# EAGLE design mainboard (EAGLE 6.5.0)
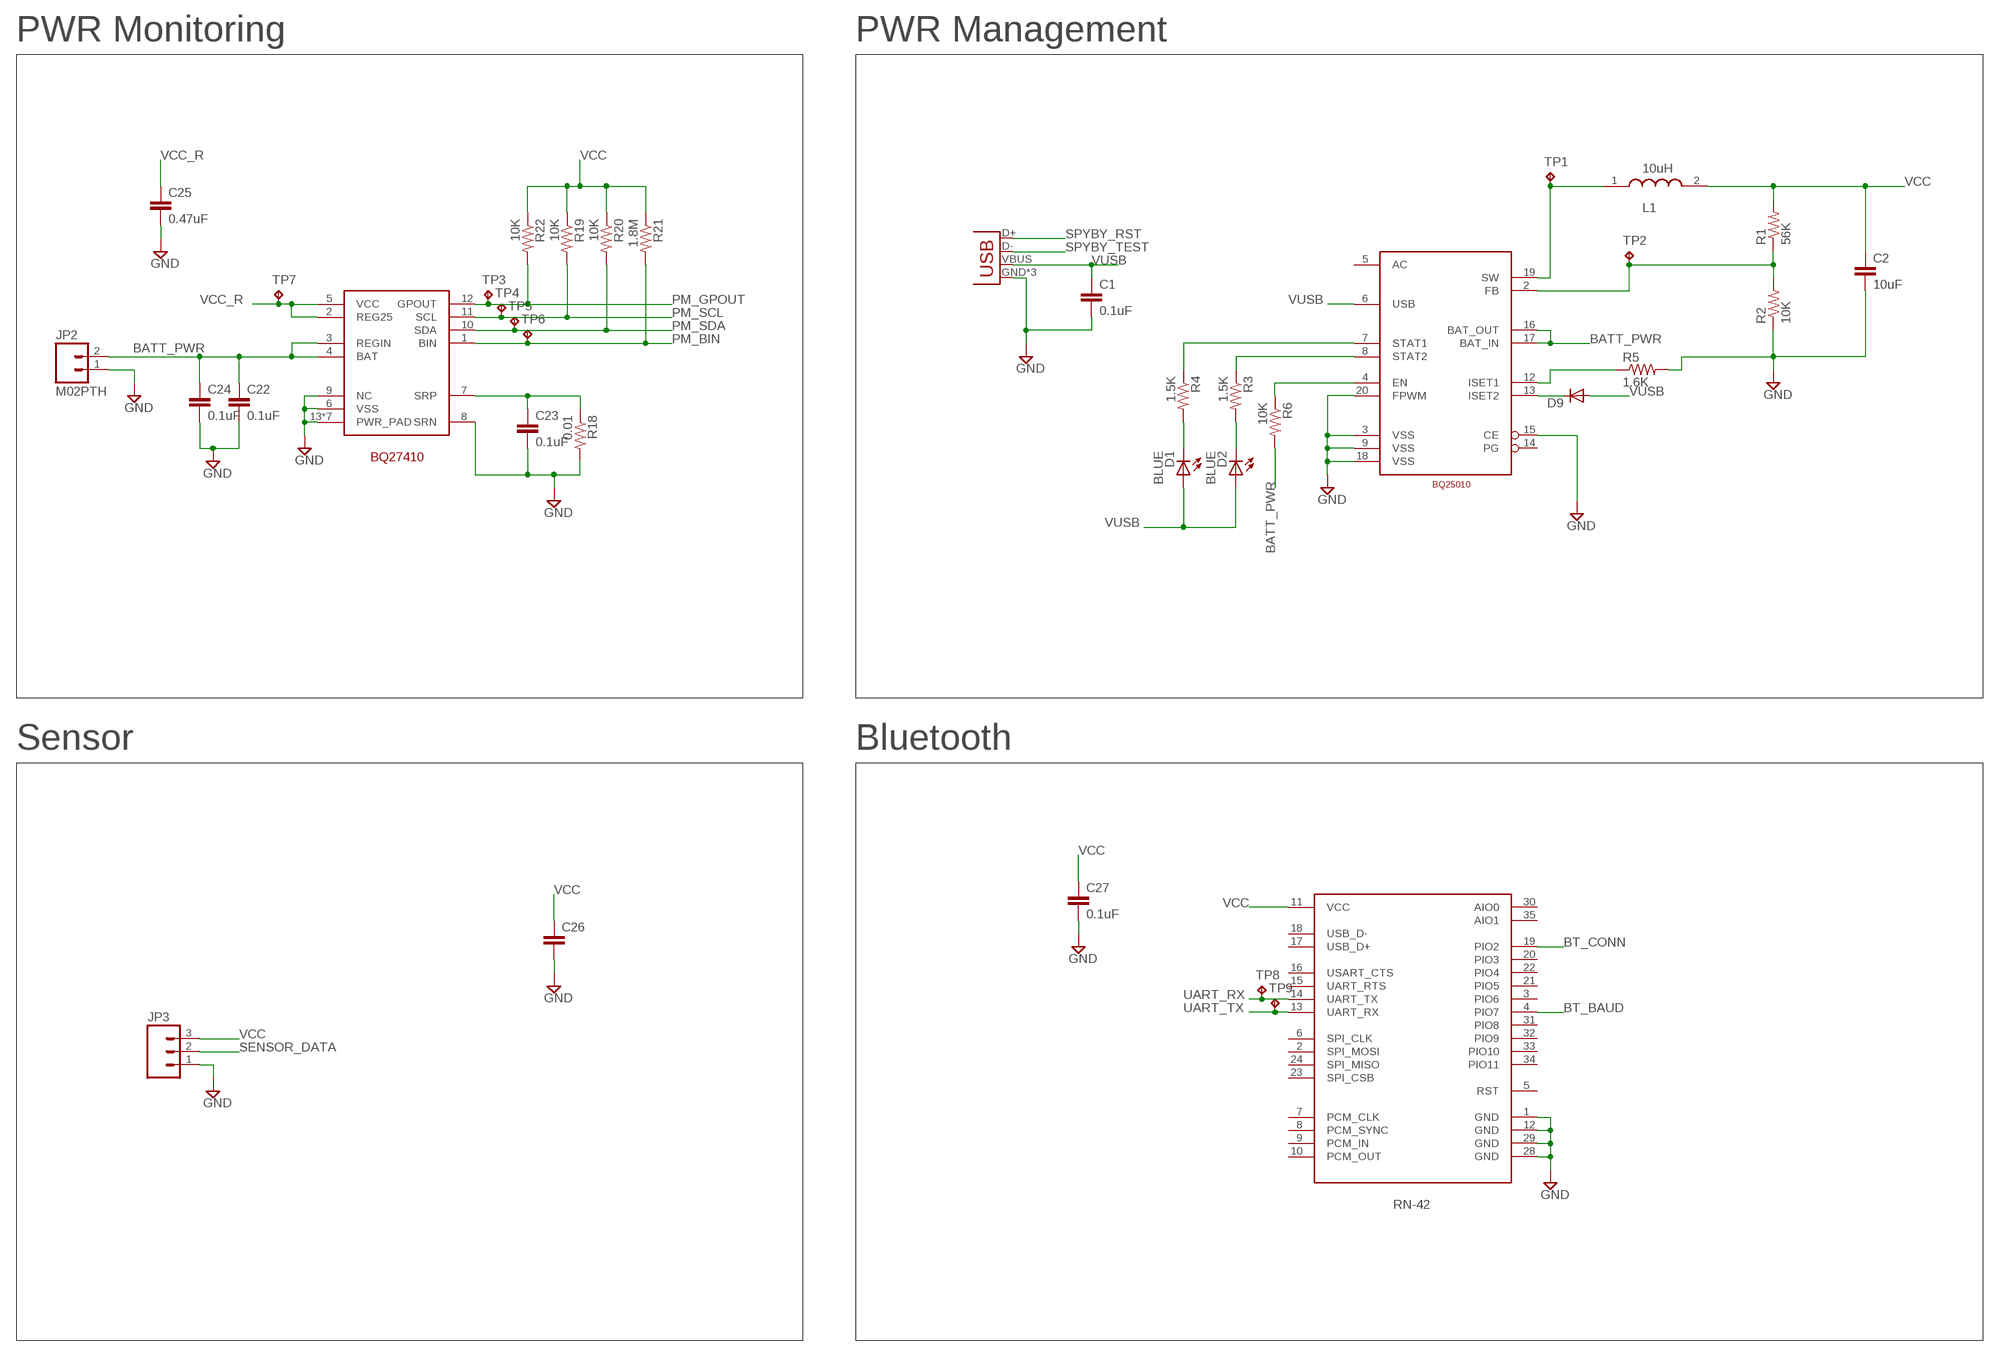
[diagram p0: schematic, sheet 1, part 1 of 2]
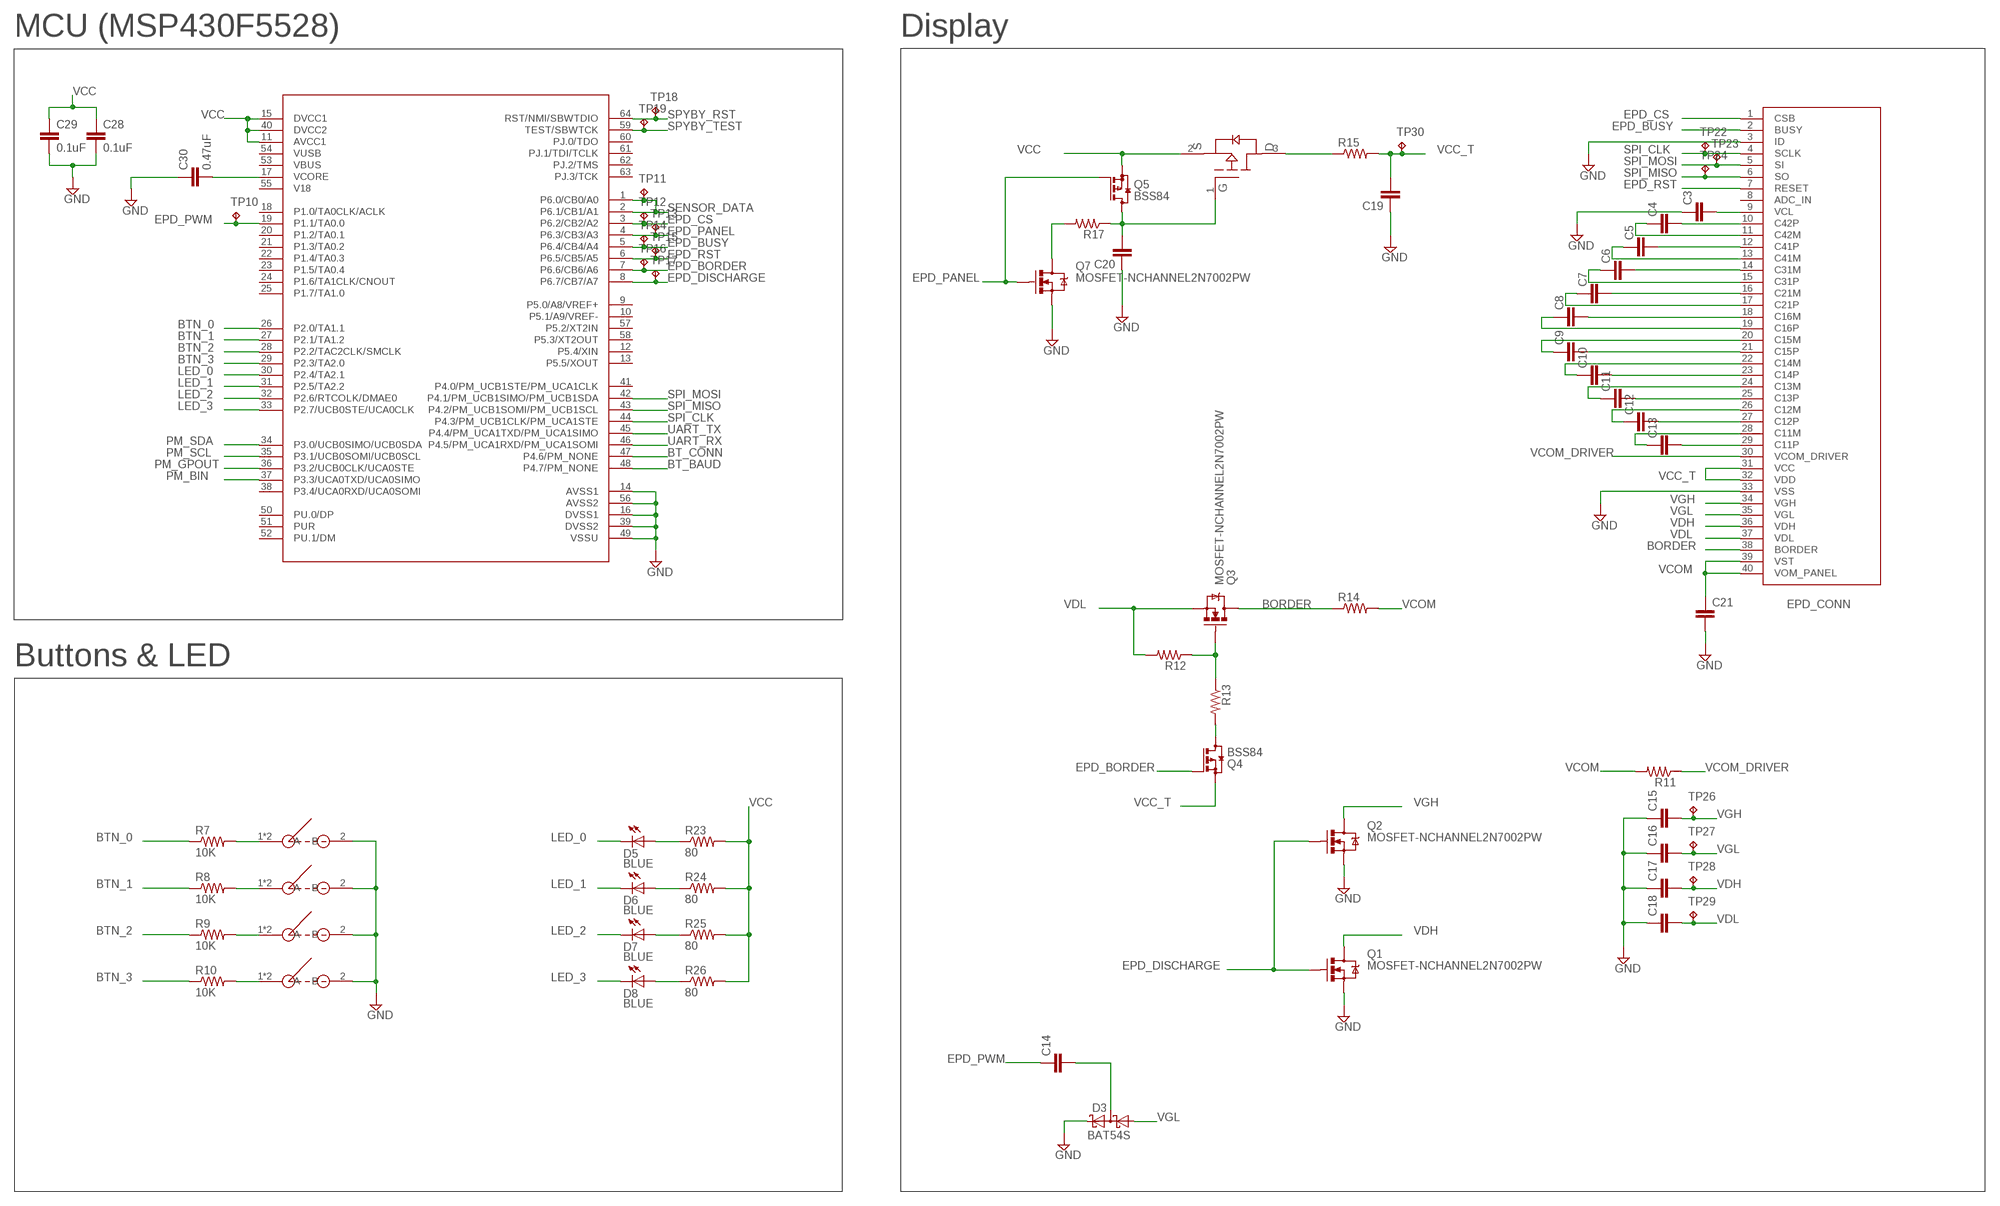
[diagram p1: schematic, sheet 1, part 2 of 2]

## Parts
C1  0.1uF  CAP0402-CAP  [0402-CAP]
C2  10uF  CAP0402-CAP  [0402-CAP]
C3  CAP0402-CAP  [0402-CAP]
C4  CAP0402-CAP  [0402-CAP]
C5  CAP0402-CAP  [0402-CAP]
C6  CAP0402-CAP  [0402-CAP]
C7  CAP0402-CAP  [0402-CAP]
C8  CAP0402-CAP  [0402-CAP]
C9  CAP0402-CAP  [0402-CAP]
C10  CAP0402-CAP  [0402-CAP]
C11  CAP0402-CAP  [0402-CAP]
C12  CAP0402-CAP  [0402-CAP]
C13  CAP0402-CAP  [0402-CAP]
C14  CAP0402-CAP  [0402-CAP]
C15  CAP0402-CAP  [0402-CAP]
C16  CAP0402-CAP  [0402-CAP]
C17  CAP0402-CAP  [0402-CAP]
C18  CAP0402-CAP  [0402-CAP]
C19  CAP0402-CAP  [0402-CAP]
C20  CAP0402-CAP  [0402-CAP]
C21  CAP0402-CAP  [0402-CAP]
C22  0.1uF  CAP0402-CAP  [0402-CAP]
C23  0.1uF  CAP0402-CAP  [0402-CAP]
C24  0.1uF  CAP0402-CAP  [0402-CAP]
C25  0.47uF  CAP0402-CAP  [0402-CAP]
C26  CAP0402-CAP  [0402-CAP]
C27  0.1uF  CAP0402-CAP  [0402-CAP]
C28  0.1uF  CAP0402-CAP  [0402-CAP]
C29  0.1uF  CAP0402-CAP  [0402-CAP]
C30  0.47uF  CAP0402-CAP  [0402-CAP]
D1  BLUE  LED-BLUE0603  [LED-0603]
D2  BLUE  LED-BLUE0603  [LED-0603]
D3  BAT54S  [SOT23]
D5  BLUE  LED-BLUE0603  [LED-0603]
D6  BLUE  LED-BLUE0603  [LED-0603]
D7  BLUE  LED-BLUE0603  [LED-0603]
D8  BLUE  LED-BLUE0603  [LED-0603]
D9  DIODESOD523  [SOD523]
JP1  USB-MICROB  [USB-MICROB]
JP2  M02PTH  [1X02]
JP3  M03PTH  [1X03]
L1  10uH  ASPI-0428S-100M-T  [ASPI_0428S-100M-T]
Q1  MOSFET-NCHANNEL2N7002PW  [SOT323]
Q2  MOSFET-NCHANNEL2N7002PW  [SOT323]
Q3  MOSFET-NCHANNEL2N7002PW  [SOT323]
Q4  BSS84  [SOT23]
Q5  BSS84  [SOT23]
Q7  MOSFET-NCHANNEL2N7002PW  [SOT323]
R1  56K  RESISTOR0402-RES  [0402-RES]
R2  10K  RESISTOR0402-RES  [0402-RES]
R3  1.5K  RESISTOR0402-RES  [0402-RES]
R4  1.5K  RESISTOR0402-RES  [0402-RES]
R5  1.6K  RESISTOR0402-RES  [0402-RES]
R6  10K  RESISTOR0402-RES  [0402-RES]
R7  10K  RESISTOR0402-RES  [0402-RES]
R8  10K  RESISTOR0402-RES  [0402-RES]
R9  10K  RESISTOR0402-RES  [0402-RES]
R10  10K  RESISTOR0402-RES  [0402-RES]
R11  RESISTOR0402-RES  [0402-RES]
R12  RESISTOR0402-RES  [0402-RES]
R13  RESISTOR0402-RES  [0402-RES]
R14  RESISTOR0402-RES  [0402-RES]
R15  RESISTOR0402-RES  [0402-RES]
R17  RESISTOR0402-RES  [0402-RES]
R18  0.01  RESISTOR0402-RES  [0402-RES]
R19  10K  RESISTOR0402-RES  [0402-RES]
R20  10K  RESISTOR0402-RES  [0402-RES]
R21  1.8M  RESISTOR0402-RES  [0402-RES]
R22  10K  RESISTOR0402-RES  [0402-RES]
R23  80  RESISTOR0402-RES  [0402-RES]
R24  80  RESISTOR0402-RES  [0402-RES]
R25  80  RESISTOR0402-RES  [0402-RES]
R26  80  RESISTOR0402-RES  [0402-RES]
TP1  TPB1,27  [B1,27]
TP2  TPB1,27  [B1,27]
TP3  TPB1,27  [B1,27]
TP4  TPB1,27  [B1,27]
TP5  TPB1,27  [B1,27]
TP6  TPB1,27  [B1,27]
TP7  TPB1,27  [B1,27]
TP8  TPB1,27  [B1,27]
TP9  TPB1,27  [B1,27]
TP10  TPB1,27  [B1,27]
TP11  TPB1,27  [B1,27]
TP12  TPB1,27  [B1,27]
TP13  TPB1,27  [B1,27]
TP14  TPB1,27  [B1,27]
TP15  TPB1,27  [B1,27]
TP16  TPB1,27  [B1,27]
TP17  TPB1,27  [B1,27]
TP18  TPB1,27  [B1,27]
TP19  TPB1,27  [B1,27]
TP22  TPB1,27  [B1,27]
TP23  TPB1,27  [B1,27]
TP24  TPB1,27  [B1,27]
TP26  TPB1,27  [B1,27]
TP27  TPB1,27  [B1,27]
TP28  TPB1,27  [B1,27]
TP29  TPB1,27  [B1,27]
TP30  TPB1,27  [B1,27]
U$1  MSP430F5528  [VQFN_RGC_64PIN]
U$2  RN-42  [RN-42]
U$3  BQ25010  [VQFN_RHL_20PIN]
U$4  EVP-AEDB2A  [EVP-AEDB2A]
U$5  EVP-AEDB2A  [EVP-AEDB2A]
U$6  EVP-AEDB2A  [EVP-AEDB2A]
U$7  EVP-AEDB2A  [EVP-AEDB2A]
U$8  FH12-40S-0.5SH  [FH12-40S-0.5SH]
U$9  BQ27410  [SON_DRZ_12PIN]
U$10  DMG2305UX  [SOT23]

## Nets
BATT_PWR: C22.1 C24.1 JP2.2 R6.2 U$3.16(BAT_OUT) U$3.17(BAT_IN) U$9.3(REGIN) U$9.4(BAT)
BORDER: Q3.3(D) R14.1 U$8.38(BORDER)
BT_BAUD: U$1.48(P4.7/PM_NONE) U$2.4(PIO7)
BT_CONN: U$1.47(P4.6/PM_NONE) U$2.19(PIO2)
BTN_0: R7.1 U$1.26(P2.0/TA1.1)
BTN_1: R8.1 U$1.27(P2.1/TA1.2)
BTN_2: R9.1 U$1.28(P2.2/TAC2CLK/SMCLK)
BTN_3: R10.1 U$1.29(P2.3/TA2.0)
EPD_BORDER: Q4.1(G) TP16.TP U$1.7(P6.6/CB6/A6)
EPD_BUSY: TP14.TP U$1.5(P6.4/CB4/A4) U$8.2(BUSY)
EPD_CS: TP12.TP U$1.3(P6.2/CB2/A2) U$8.1(CSB)
EPD_DISCHARGE: Q1.1(G) Q2.1(G) TP17.TP U$1.8(P6.7/CB7/A7)
EPD_PANEL: Q5.1(G) Q7.1(G) TP13.TP U$1.4(P6.3/CB3/A3)
EPD_PWM: C14.1 TP10.TP U$1.19(P1.1/TA0.0)
EPD_RST: TP15.TP U$1.6(P6.5/CB5/A5) U$8.7(RESET)
GND [GND]: C1.2 C2.2 C3.1 C15.1 C16.1 C17.1 C18.1 C19.1 C20.1 C21.2 C22.2 C23.2 C24.2 C25.2 C26.2 C27.2 C28.2 C29.2 C30.1 D3.2(C2) JP1.GND JP1.MT1(GND) JP1.MT2(GND) JP2.1 JP3.1 Q1.2(S) Q2.2(S) Q7.2(S) R2.1 R5.2 R18.2 U$1.14(AVSS1) U$1.16(DVSS1) U$1.39(DVSS2) U$1.49(VSSU) U$1.56(AVSS2) U$2.1(GND) U$2.12(GND) U$2.28(GND) U$2.29(GND) U$3.3(VSS) U$3.9(VSS) U$3.15(CE) U$3.18(VSS) U$3.20(FPWM) U$4.2(B) U$5.2(B) U$6.2(B) U$7.2(B) U$8.3(ID) U$8.33(VSS) U$9.6(VSS) U$9.8(SRN) U$9.9(NC) U$9.13(PWR_PAD) U$9.P$15(PWR_PAD) U$9.P$16(PWR_PAD) U$9.P$17(PWR_PAD) U$9.P$18(PWR_PAD) U$9.P$19(PWR_PAD) U$9.P$20(PWR_PAD)
LED_0: D5.C U$1.30(P2.4/TA2.1)
LED_1: D6.C U$1.31(P2.5/TA2.2)
LED_2: D7.C U$1.32(P2.6/RTCOLK/DMAE0)
LED_3: D8.C U$1.33(P2.7/UCB0STE/UCA0CLK)
N$1: R5.1 U$3.12(ISET1)
N$2: D1.C R4.2
N$3: D9.C U$3.13(ISET2)
N$4: D2.C R3.2
N$5: R1.1 R2.2 TP2.TP U$3.2(FB)
N$6: L1.1 TP1.TP U$3.19(SW)
N$7: C30.2 U$1.17(VCORE)
N$8: Q4.3(D) R13.2
N$9: C14.2 D3.3(C1A2)
N$10: R4.1 U$3.7(STAT1)
N$11: R3.1 U$3.8(STAT2)
N$12: R6.1 U$3.4(EN)
N$13: R7.2 U$4.1'(A) U$4.1(A)
N$14: R8.2 U$5.1'(A) U$5.1(A)
N$15: R9.2 U$6.1'(A) U$6.1(A)
N$16: R10.2 U$7.1'(A) U$7.1(A)
N$26: C4.2 U$8.10(C42P)
N$27: C4.1 U$8.11(C42M)
N$28: C5.2 U$8.12(C41P)
N$29: C5.1 U$8.13(C41M)
N$30: C6.2 U$8.14(C31M)
N$31: C6.1 U$8.15(C31P)
N$32: C7.2 U$8.16(C21M)
N$33: C7.1 U$8.17(C21P)
N$34: C8.2 U$8.18(C16M)
N$35: C8.1 U$8.19(C16P)
N$36: C9.1 U$8.20(C15M)
N$37: C9.2 U$8.21(C15P)
N$38: C10.1 U$8.22(C14M)
N$39: C10.2 U$8.23(C14P)
N$40: C11.1 U$8.24(C13M)
N$41: C11.2 U$8.25(C13P)
N$42: C12.1 U$8.26(C12M)
N$43: C12.2 U$8.27(C12P)
N$44: C13.1 U$8.28(C11M)
N$45: C13.2 U$8.29(C11P)
N$46: C3.2 U$8.9(VCL)
N$47: R15.1 U$10.3(DRAIN)
N$48: D5.A R23.1
N$49: Q3.1(G) R12.1 R13.1
N$50: C20.2 Q5.3(D) R17.1 U$10.1(GATE)
N$51: D6.A R24.1
N$52: Q7.3(D) R17.2
N$54: C23.1 R18.1 U$9.7(SRP)
N$55: D7.A R25.1
N$56: D8.A R26.1
PM_BIN: R21.2 TP6.TP U$1.37(P3.3/UCA0TXD/UCA0SIMO) U$9.1(BIN)
PM_GPOUT: R22.2 TP3.TP U$1.36(P3.2/UCB0CLK/UCA0STE) U$9.12(GPOUT)
PM_SCL: R19.2 TP4.TP U$1.35(P3.1/UCB0SOMI/UCB0SCL) U$9.11(SCL)
PM_SDA: R20.2 TP5.TP U$1.34(P3.0/UCB0SIMO/UCB0SDA) U$9.10(SDA)
SENSOR_DATA: JP3.2 TP11.TP U$1.1(P6.0/CB0/A0) U$1.2(P6.1/CB1/A1)
SPI_CLK: TP22.TP U$1.44(P4.3/PM_UCB1CLK/PM_UCA1STE) U$8.4(SCLK)
SPI_MISO: TP24.TP U$1.43(P4.2/PM_UCB1SOMI/PM_UCB1SCL) U$8.6(SO)
SPI_MOSI: TP23.TP U$1.42(P4.1/PM_UCB1SIMO/PM_UCB1SDA) U$8.5(SI)
SPYBY_RST: JP1.D+ TP18.TP U$1.64(RST/NMI/SBWTDIO)
SPYBY_TEST: JP1.D- TP19.TP U$1.59(TEST/SBWTCK)
UART_RX: TP8.TP U$1.46(P4.5/PM_UCA1RXD/PM_UCA1SOMI) U$2.14(UART_TX)
UART_TX: TP9.TP U$1.45(P4.4/PM_UCA1TXD/PM_UCA1SIMO) U$2.13(UART_RX)
VCC [VCC]: C2.1 C26.1 C27.1 C28.1 C29.1 JP3.3 L1.2 Q5.2(S) R1.2 R19.1 R20.1 R21.1 R22.1 R23.2 R24.2 R25.2 R26.2 U$1.11(AVCC1) U$1.15(DVCC1) U$1.40(DVCC2) U$2.11(VCC) U$10.2(SOURCE)
VCC_R: C25.1 TP7.TP U$9.2(REG25) U$9.5(VCC)
VCC_T: C19.2 Q4.2(S) R15.2 TP30.TP U$8.31(VCC) U$8.32(VDD)
VCOM: C21.1 R11.2 R14.2 U$8.39(VST) U$8.40(VOM_PANEL)
VCOM_DRIVER: R11.1 U$8.30(VCOM_DRIVER)
VDH: C17.2 Q1.3(D) TP28.TP U$8.36(VDH)
VDL: C18.2 Q3.2(S) R12.2 TP29.TP U$8.37(VDL)
VGH: C15.2 Q2.3(D) TP26.TP U$8.34(VGH)
VGL: C16.2 D3.1(A1) TP27.TP U$8.35(VGL)
VUSB: C1.1 D1.A D2.A D9.A JP1.VBUS U$3.6(USB)
Unconnected: U$1.9(P5.0/A8/VREF+) U$1.10(P5.1/A9/VREF-) U$1.12(P5.4/XIN) U$1.13(P5.5/XOUT) U$1.18(P1.0/TA0CLK/ACLK) U$1.20(P1.2/TA0.1) U$1.21(P1.3/TA0.2) U$1.22(P1.4/TA0.3) U$1.23(P1.5/TA0.4) U$1.24(P1.6/TA1CLK/CNOUT) U$1.25(P1.7/TA1.0) U$1.38(P3.4/UCA0RXD/UCA0SOMI) U$1.41(P4.0/PM_UCB1STE/PM_UCA1CLK) U$1.50(PU.0/DP) U$1.51(PUR) U$1.52(PU.1/DM) U$1.53(VBUS) U$1.54(VUSB) U$1.55(V18) U$1.57(P5.2/XT2IN) U$1.58(P5.3/XT2OUT) U$1.60(PJ.0/TDO) U$1.61(PJ.1/TDI/TCLK) U$1.62(PJ.2/TMS) U$1.63(PJ.3/TCK) U$2.2(SPI_MOSI) U$2.3(PIO6) U$2.5(RST) U$2.6(SPI_CLK) U$2.7(PCM_CLK) U$2.8(PCM_SYNC) U$2.9(PCM_IN) U$2.10(PCM_OUT) U$2.15(UART_RTS) U$2.16(USART_CTS) U$2.17(USB_D+) U$2.18(USB_D-) U$2.20(PIO3) U$2.21(PIO5) U$2.22(PIO4) U$2.23(SPI_CSB) U$2.24(SPI_MISO) U$2.30(AIO0) U$2.31(PIO8) U$2.32(PIO9) U$2.33(PIO10) U$2.34(PIO11) U$2.35(AIO1) U$3.5(AC) U$3.14(PG) U$8.8(ADC_IN)

## Notes on the sheet
- PWR Monitoring | PWR Management | MCU (MSP430F5528) | Display
- 10uH
- L1
- Sensor | Bluetooth | Buttons & LED

## Library data of the parts
C1-C30 = SparkFun-Capacitors:CAP: Capacitor Standard 0603 ceramic capacitor, and 0.1" leaded capacitor.
D1 D2 D5-D8 = SparkFun-LED:LED-BLUE: Blue LEDs for production use Various blue LEDs stocked by SparkFun production 0603 - DIO-08575 Rebel - DIO-09553 1206 - DIO-09911; PROD_ID: DIO-08575
D3 = diode:BAT54S: Schottky Diodes Pin connection corrected 2011-05-04 Source: Fairchild .. BAT54.pdf
D9 = SparkFun-DiscreteSemi:DIODE: Diode These are standard reverse protection diodes and small signal diodes. SMA package can handle up to about 1A. SOD-323 can handle about 200mA. What the SOD-323 package when ordering, there are some mfgs out there that are 5-pin packages.
JP1 = SparkFun-Connectors:USB: USB Connectors USB-B-PTH is fully proven SKU : PRT-00139/CONN-08278 USB-miniB is fully proven SKU : PRT-00587 USB-A-PCB is untested. USB-A-H is throughly reviewed, but untested. Spark Fun Electronics SKU : PRT-00437 USB-B-SMT is throughly reviewed, but untested. Needs silkscreen touching up. USB-A-S has not been used/tested USB-MB-H has not been used/tested USB-MICROB has been used. CONN-09505; PROD_ID: CONN-09505
JP2 = SparkFun-Connectors:M02: Standard 2-pin 0.1" header. Use with - straight break away headers ( PRT-00116) - right angle break away headers (PRT-00553) - swiss pins (PRT-00743) - machine pins (PRT-00117) - female headers (PRT-00115) Molex polarized connector foot print use with: PRT-08233 with associated crimp pins and housings. 2.54_SCREWTERM for use with PRT-10571. 3.5mm Screw Terminal footprints for PRT-08084 5mm Screw Terminal footprints for use with PRT-08433
JP3 = SparkFun-Connectors:M03: Header 3 Standard 3-pin 0.1" header. Use with straight break away headers (SKU : PRT-00116), right angle break away headers (PRT-00553), swiss pins (PRT-00743), machine pins (PRT-00117), and female headers (PRT-00115). Molex polarized connector foot print use with SKU : PRT-08232 with associated crimp pins and housings.
L1 = TuansLib:ASPI-0428S-100M-T
Q1-Q3 Q7 = SparkFun-DiscreteSemi:MOSFET-NCHANNEL: Common NMOSFET Parts MFG P/N Store ID Prod ID FDD8780 TRANS-09984 SI7820DN TRANS-11055 FDS6630A IC-08089 2N7002PW TRANS-11151 FQP30N06L COM-10213 TRANS-10060 BSS123LT1G TRANS-08345 BSS138 TRANS-00830 BS170 2N7000; PROD_ID: TRANS-11151
Q4 Q5 = transistor-small-signal:BSS84: P-CHANNEL MOS FET
R1-R15 R17-R26 = SparkFun-Passives:RESISTOR: Resistor Basic schematic elements and footprints for 0603, 1206, and PTH resistors.
TP1-TP19 TP22-TP24 TP26-TP30 = testpad:TP: Test pad
U$1 = TuansLib:MSP430F5528
U$2 = TuansLib:RN-42
U$3 = TuansLib:BQ25010
U$4-U$7 = TuansLib:EVP-AEDB2A
U$8 = TuansLib:FH12-40S-0.5SH
U$9 = TuansLib:BQ27410
U$10 = TuansLib:DMG2305UX

## Net classes
1 VCC: width 0.254 mm
2 GND: width 0.254 mm

## Board
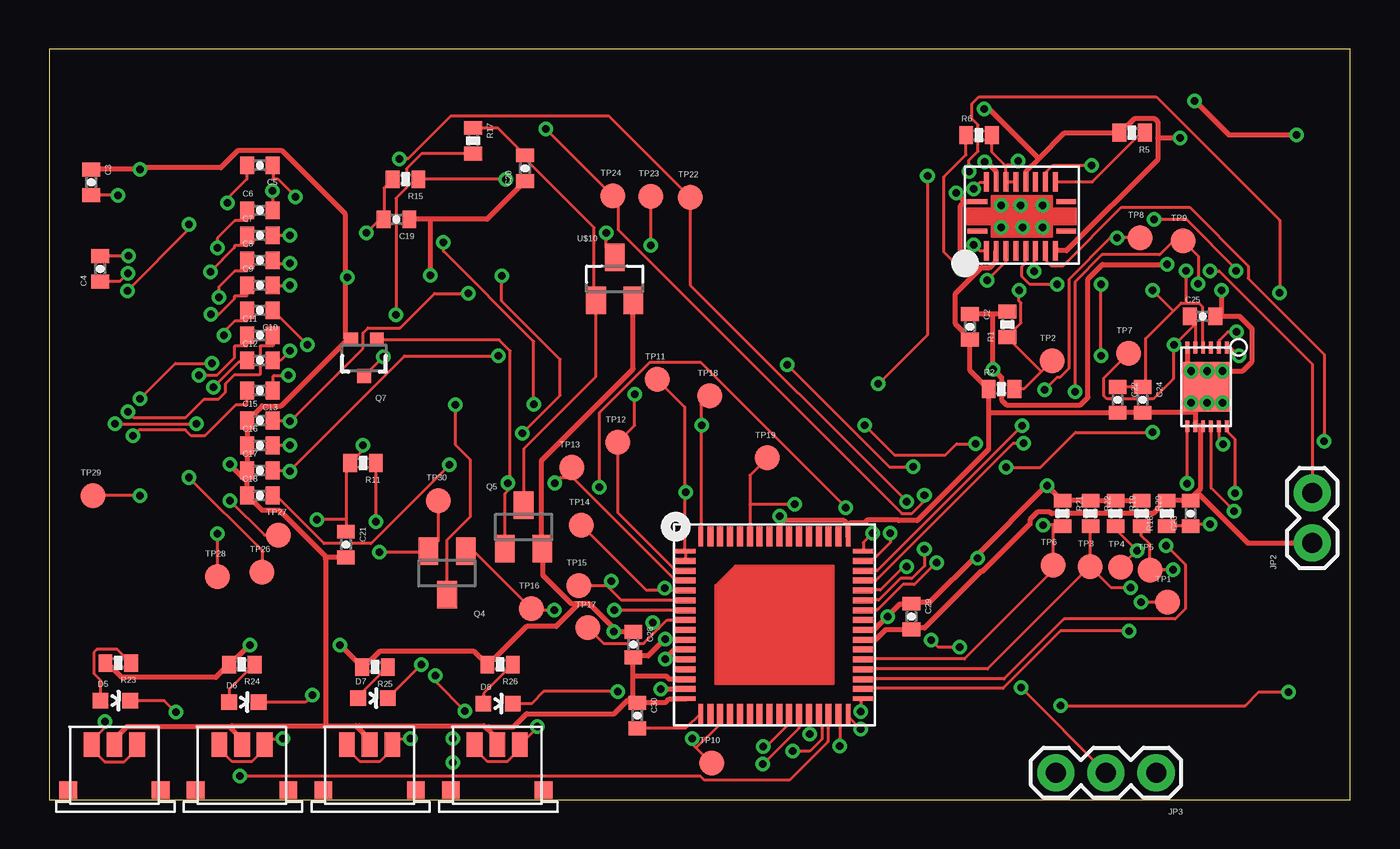
[diagram p2: board, top side]
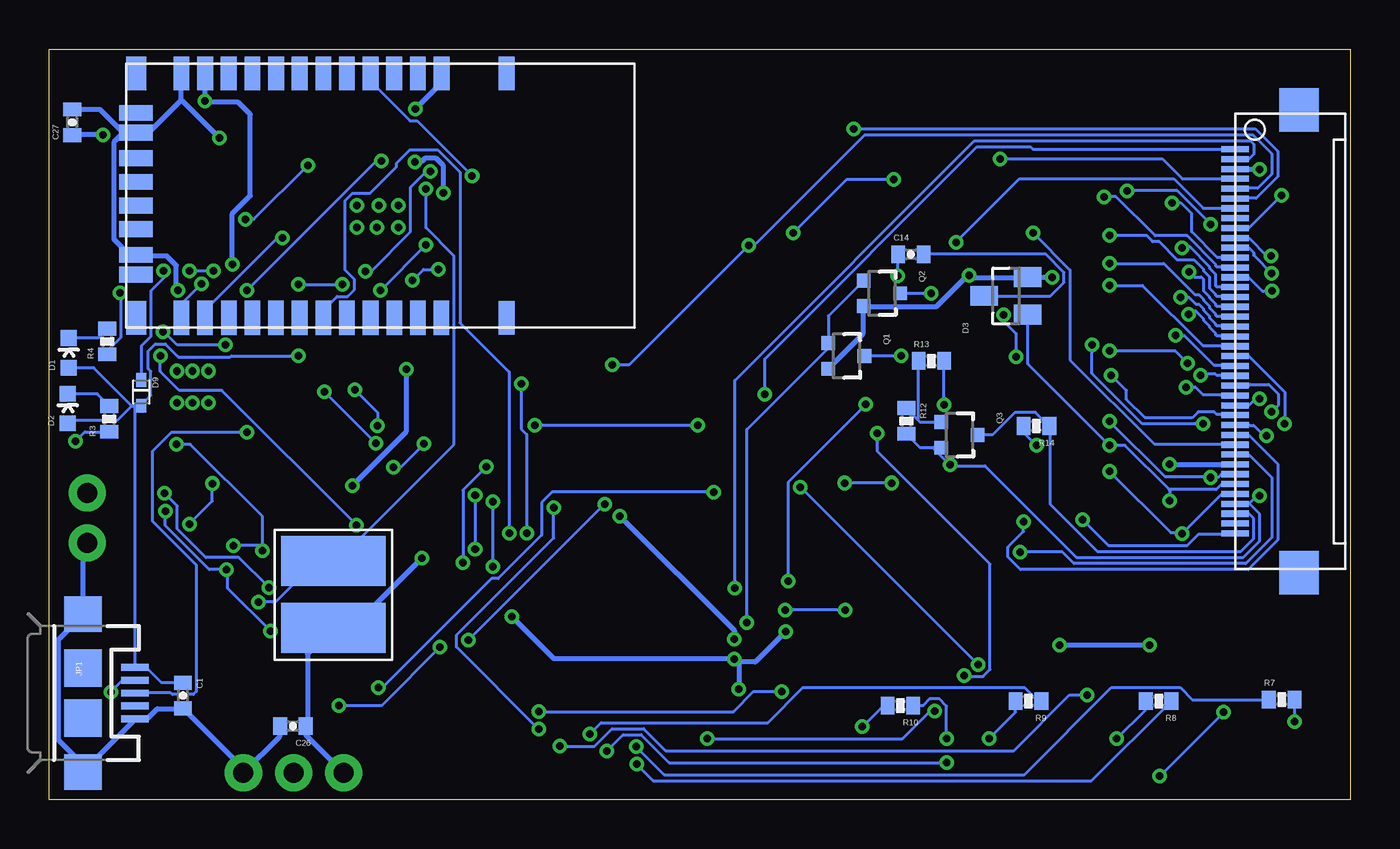
[diagram p3: board, bottom side, seen from below]

Size 66.04 x 38.1 mm. Coordinates in mm from the lower left corner, seen from the top.
Outline: 0,0 66.04,0 66.04,38.1 0,38.1 0,0
Copper layers (1*16): Top 0.035mm / dielectric 1.5mm / Bottom 0.035mm
Design rules "default *": minimum track width 6mil, minimum drill 15mil, track to track 6mil, track to pad 6mil, pad to pad 6mil, via to via 6mil, smd to smd 6mil, copper to edge 10mil, drill to drill 8mil, minimum pad ring 7mil, minimum via ring 7mil, stop-mask expansion 3mil, vias tented up to drill 0mil, thermal gap 10mil

### Footprints (pad centres in the part's own frame; a part is rotated, then mirrored left to right if it is on the bottom)
0402-CAP = smd 0.7 x 0.9: 1 -0.65,0; 2 0.65,0
LED-0603 = smd 0.8 x 0.8: A 0,-0.75; C 0,0.75
SOT23 = smd 1 x 1.4: 1 -0.95,-1.1; 2 0.95,-1.1; 3 0,1.1
SOD523 = smd 0.7 x 0.5: A 0.7,0; C -0.6,0
USB-MICROB = smd 0.35 x 1.4: D+ 0,2.65; D- -0.65,2.65; GND 1.3,2.65; ID 0.65,2.65; VBUS -1.3,2.65 | smd 1.8 x 1.9: MT1 -4,0; MT2 4,0 | smd 1.9 x 1.9: P$1 -1.27,0; P$2 1.27,0
1X02 = drill 1.016 pad 1.88: 1 0,0; 2 2.54,0
1X03 = drill 1.016 pad 1.88: 1 0,0; 2 2.54,0; 3 5.08,0
ASPI_0428S-100M-T = smd 5.309 x 2.54: 1 0,0; 2 0,3.404
SOT323 = smd 0.7 x 0.7: 1 -0.65,-0.925; 2 0.65,-0.925; 3 0,0.925
0402-RES = smd 0.7 x 0.9: 1 -0.65,0; 2 0.65,0
B1,27 = smd 1.27 x 1.27: TP 0,0
VQFN_RGC_64PIN = smd 1.016 x 0.229: 1 0,8.25; 16 0,0.75; 33 9,0.75; 48 9,8.25 | smd 1.016 x 0.305: 2 0,7.75; 3 0,7.25; 4 0,6.75; 5 0,6.25; 6 0,5.75; 7 0,5.25; 8 0,4.75; 9 0,4.25; 10 0,3.75; 11 0,3.25; 12 0,2.75; 13 0,2.25; 14 0,1.75; 15 0,1.25; 34 9,1.25; 35 9,1.75; 36 9,2.25; 37 9,2.75; 38 9,3.25; 39 9,3.75; 40 9,4.25; 41 9,4.75; 42 9,5.25; 43 9,5.75; 44 9,6.25; 45 9,6.75; 46 9,7.25; 47 9,7.75 | smd 0.229 x 1.016: 17 0.75,0; 32 8.25,0; 49 8.25,9; 64 0.75,9 | smd 0.305 x 1.016: 18 1.25,0; 19 1.75,0; 20 2.25,0; 21 2.75,0; 22 3.25,0; 23 3.75,0; 24 4.25,0; 25 4.75,0; 26 5.25,0; 27 5.75,0; 28 6.25,0; 29 6.75,0; 30 7.25,0; 31 7.75,0; 50 7.75,9; 51 7.25,9; 52 6.75,9; 53 6.25,9; 54 5.75,9; 55 5.25,9; 56 4.75,9; 57 4.25,9; 58 3.75,9; 59 3.25,9; 60 2.75,9; 61 2.25,9; 62 1.75,9; 63 1.25,9
RN-42 = smd 1.7 x 0.8: 1 0.5,16; 2 0.5,14.8; 3 0.5,13.6; 4 0.5,12.4; 5 0.5,11.2; 6 0.5,10; 7 0.5,8.8; 8 0.5,7.6; 9 0.5,6.4; 10 0.5,5.2; 11 0.5,4; 12 0.5,2.8; 13 12.9,2.8; 14 12.9,4; 15 12.9,5.2; 16 12.9,6.4; 17 12.9,7.6; 18 12.9,8.8; 19 12.9,10; 20 12.9,11.2; 21 12.9,12.4; 22 12.9,13.6; 23 12.9,14.8; 24 12.9,16; P$35 0.5,19.3; P$36 12.9,19.3 | smd 0.8 x 1.7: 28 9.7,0.5; 29 3.5,0.5; 30 10.7,0.5; 31 8.4,0.5; 32 7.2,0.5; 33 6,0.5; 34 4.8,0.5; 35 2.5,0.5 | smd 1.7 x 1: P$33 0.5,0.5; P$34 12.9,0.5
VQFN_RHL_20PIN = smd 1 x 0.25: 1 0,1; 10 4.5,1; 11 4.5,2.5; 20 0,2.5 | smd 0.25 x 1: 2 0.45,0; 3 0.95,0; 4 1.45,0; 5 1.95,0; 6 2.45,0; 7 2.95,0; 8 3.45,0; 9 3.95,0; 12 3.95,3.5; 13 3.45,3.5; 14 2.95,3.5; 15 2.45,3.5; 16 1.95,3.5; 17 1.45,3.5; 18 0.95,3.5; 19 0.45,3.5 | drill 0.381: P$21 1.2,2.3; P$22 1.2,1.2; P$23 2.3,1.2; P$24 2.2,2.3; P$25 3.3,2.3; P$26 3.3,1.2
EVP-AEDB2A = smd 0.8 x 1.25: 1 0,0; 1' 2.3,0; 2 1.15,0 | smd 0.9 x 0.9: P$4 -1.2,-2.3; P$5 3.5,-2.3
FH12-40S-0.5SH = smd 0.31 x 1.4: 1 0,0; 2 0.5,0; 3 1,0; 4 1.5,0; 5 2,0; 6 2.5,0; 7 3,0; 8 3.5,0; 9 4,0; 10 4.5,0; 11 5,0; 12 5.5,0; 13 6,0; 14 6.5,0; 15 7,0; 16 7.5,0; 17 8,0; 18 8.5,0; 19 9,0; 20 9.5,0; 21 10,0; 22 10.5,0; 23 11,0; 24 11.5,0; 25 12,0; 26 12.5,0; 27 13,0; 28 13.5,0; 29 14,0; 30 14.5,0; 31 15,0; 32 15.5,0; 33 16,0; 34 16.5,0; 35 17,0; 36 17.5,0; 37 18,0; 38 18.5,0; 39 19,0; 40 19.5,0 | smd 2.2 x 2: G@0 -2,3.25; G@1 21.5,3.25
SON_DRZ_12PIN = smd 0.2 x 0.6: 1 0.2,0; 2 0.6,0; 3 1,0; 4 1.4,0; 5 1.8,0; 6 2.2,0; 7 2.2,4; 8 1.8,4; 9 1.4,4; 10 1,4; 11 0.6,4; 12 0.2,4 | smd 2.5 x 2.5: 13 1.25,2 | drill 0.381: P$15 0.4,2.8; P$16 1.2,2.8; P$17 2,2.8; P$18 2,1.2; P$19 1.2,1.2; P$20 0.4,1.2

### Placement (x,y rotation side)
C1  59.26,5.28 270 bottom
C2  46.74,24 270 top
C3  2.13,31.34 270 top
C4  2.59,26.95 90 top
C5  10.69,32.21 180 top
C6  10.69,29.92 0 top
C7  10.69,28.65 0 top
C8  10.69,27.38 0 top
C9  10.69,26.11 0 top
C10  10.69,24.84 180 top
C11  10.69,23.57 0 top
C12  10.69,22.3 0 top
C13  10.69,20.78 180 top
C14  22.3,27.69 0 bottom
C15  10.69,19.25 0 top
C16  10.69,17.98 0 top
C17  10.69,16.71 0 top
C18  10.69,15.44 0 top
C19  17.63,29.46 180 top
C20  24.16,32.05 90 top
C21  15.06,12.95 270 top
C22  54.23,20.29 270 top
C23  57.94,14.53 90 top
C24  55.5,20.29 270 top
C25  58.55,24.54 0 top
C26  53.67,3.73 180 bottom
C27  64.87,34.39 90 bottom
C28  29.64,7.87 270 top
C29  43.76,9.3 270 top
C30  29.84,4.27 270 top
D1  65.05,22.68 0 bottom
D2  65.1,19.86 0 bottom
D3  17.48,25.58 90 bottom
D5  3.35,5.03 270 top
D6  9.88,4.95 270 top
D7  16.43,5.16 270 top
D8  22.78,4.88 270 top
D9  61.37,20.7 270 bottom
JP1  64.34,5.41 270 bottom
JP2  64.11,13.03 90 top
JP3  56.18,1.37 180 top
L1  51.61,12.12 180 bottom
Q1  25.58,22.53 270 bottom
Q2  23.77,25.7 270 bottom
Q3  19.84,18.52 270 bottom
Q4  20.19,11.51 180 top
Q5  24.08,13.84 0 top
Q7  15.98,22.43 180 top
R1  48.64,24.13 90 top
R2  48.34,20.85 0 top
R3  62.99,19.33 90 bottom
R4  63.09,23.27 90 bottom
R5  54.97,33.86 180 top
R6  47.19,33.73 0 top
R7  3.48,5.08 0 bottom
R8  9.73,5 180 bottom
R9  16.33,5 180 bottom
R10  22.83,4.78 180 bottom
R11  15.93,17.09 180 top
R12  22.53,19.23 270 bottom
R13  21.26,22.28 0 bottom
R14  15.93,18.97 180 bottom
R15  18.08,31.5 180 top
R17  21.51,33.45 270 top
R18  56.72,14.53 90 top
R19  54.13,14.53 270 top
R20  55.45,14.53 270 top
R21  51.44,14.53 270 top
R22  52.86,14.53 270 top
R23  3.51,6.93 180 top
R24  9.78,6.86 180 top
R25  16.54,6.73 180 top
R26  22.89,6.86 180 top
TP1  56.77,10.03 0 top
TP2  50.9,22.28 0 top
TP3  52.83,11.84 0 top
TP4  54.38,11.81 0 top
TP5  55.88,11.66 0 top
TP6  50.95,11.91 0 top
TP7  54.79,22.66 0 top
TP8  55.37,28.52 0 top
TP9  57.56,28.37 0 top
TP10  33.63,1.85 0 top
TP11  30.86,21.34 0 top
TP12  28.85,18.14 0 top
TP13  26.52,16.87 0 top
TP14  27,13.94 0 top
TP15  26.87,10.87 0 top
TP16  24.46,9.7 0 top
TP17  27.33,8.74 0 top
TP18  33.53,20.5 0 top
TP19  36.45,17.35 0 top
TP22  32.54,30.58 0 top
TP23  30.53,30.63 0 top
TP24  28.6,30.66 0 top
TP26  10.79,11.56 0 top
TP27  11.63,13.44 0 top
TP28  8.53,11.33 0 top
TP29  2.21,15.44 0 top
TP30  19.76,15.19 0 top
U$1  32.31,4.37 0 top
U$2  62.13,37.36 270 bottom
U$3  47.12,27.86 0 top
U$4  2.16,2.79 0 top
U$5  8.64,2.79 0 top
U$6  15.11,2.79 0 top
U$7  21.59,2.79 0 top
U$8  5.84,33.02 270 bottom
U$9  59.97,22.96 180 top
U$10  28.7,26.44 0 top

### Tracks (layer width: path | path; a pad name or v marks a point on that pad's centre or on a via)
BATT_PWR  (via drill 0.38)
  Top 0.152: 48.56,32.16 47.85,32.87 47.85,33.73 R6.2 | 48.56,32.16 U$3.17 48.64,31.37 49.05,31.37 U$3.16 | U$9.3 U$9.4 58.52,23.01 58.52,25.04 58.34,25.22 57.71,25.22 | 57.71,25.22 57.45,25.22 57.05,24.82 | 57.05,24.82 55.65,23.42 55.65,21.11 55.5,20.95 C24.1 55.45,20.95 54.23,20.95 C22.1 | v49.17,32.44 48.95,32.21 48.62,32.21 48.56,32.16 | 57.05,24.82 v56.01,25.86 | JP2.2 64.11,22.12 59.38,26.85 v58.93,26.85 | 57.71,25.22 v57.71,26.85
  Bottom 0.152: v49.17,32.44 49.43,32.44 v56.01,25.86 | v57.71,26.85 v58.93,26.85
BORDER
  Bottom 0.152: Q3.3 18.16,18.52 17.02,19.66 15.98,19.66 15.29,18.97 R14.1 15.24,18.92 15.24,15.01 12.83,12.6 5.56,12.6 4.9,13.26 4.9,14.28 5.13,14.5 5.84,14.5 U$8.38
BT_BAUD  (via drill 0.38)
  Top 0.152: v41.81,13.54 41.33,13.06 41.33,12.62 U$1.48 | v42.09,21.11 44.58,23.6 v44.58,31.67
  Bottom 0.152: v41.81,13.54 41.81,18.54 42.09,18.82 v42.09,21.11 | v44.58,31.67 47.37,34.47 47.73,34.47 49.71,36.45 49.71,36.85 U$2.4
BT_CONN  (via drill 0.38)
  Top 0.152: v42.7,13.54 42.7,13.06 41.78,12.14 41.33,12.14 U$1.47
  Bottom 0.152: v42.7,13.54 42.7,21.72 45.19,24.21 45.19,31.85 46.33,32.99 47.73,32.99 48.41,32.31 48.41,32.13 49.76,30.79 50.65,30.79 51.03,30.4 51.03,26.9 50.55,26.42 50.55,25.91 50.9,25.55 51.44,25.55 52.12,24.87 52.12,24.49 U$2.19
BTN_0  (via drill 0.38)
  Top 0.152: v36.25,2.69 36.37,2.69 37.54,3.86 37.54,4.37 U$1.26
  Bottom 0.152: R7.1 8.03,5.08 8.64,5.69 12.12,5.69 16.54,1.27 34.82,1.27 v36.25,2.69
BTN_1  (via drill 0.38)
  Top 0.152: v36.22,1.8 38.05,3.63 38.05,4.37 U$1.27
  Bottom 0.152: v36.22,1.8 35.38,0.96 13.13,0.96 9.09,5 R8.1
BTN_2  (via drill 0.38)
  Top 0.152: v38.61,3.33 38.61,4.34 38.58,4.37 U$1.28
  Bottom 0.152: R9.1 15.85,5 16.54,5.69 27.79,5.69 29.57,3.91 38.02,3.91 v38.61,3.33
BTN_3  (via drill 0.38)
  Top 0.152: v20.5,1.88 v20.5,3.1 | v37.74,2.46 38.61,2.46 39.22,3.07 39.22,3.71 39.06,3.86 U$1.29
  Bottom 0.152: R10.1 21.69,4.78 21.36,5.11 20.85,5.11 20.5,4.75 v20.5,3.1 | v20.5,1.88 34.57,1.88 35.99,3.3 36.91,3.3 v37.74,2.46
EPD_BORDER  (via drill 0.38)
  Top 0.152: v28.68,9.63 U$1.7 | v25.63,9.63 24.54,9.63 TP16.TP 21.57,12.6 21.16,12.6 Q4.1
  Bottom 0.152: v25.63,9.63 v28.68,9.63
EPD_BUSY  (via drill 0.38)
  Top 0.152: 31.24,10.64 30.3,10.64 TP14.TP | 31.24,10.64 32.31,10.64 U$1.5 | v31.24,10.74 31.24,10.64
  Bottom 0.152: v31.24,10.74 31.24,21.29 19.07,33.45 5.08,33.45 4.9,33.27 4.9,32.77 5.13,32.54 5.84,32.54 U$8.2
EPD_CS  (via drill 0.38)
  Top 0.152: U$1.3 32.31,11.63 31.8,11.63 28.85,14.58 TP12.TP 29.72,19 v29.72,20.57
  Bottom 0.152: U$8.1 16.1,33.02 16.23,33.15 18.95,33.15 29.72,22.38 v29.72,20.57
EPD_DISCHARGE  (via drill 0.38)
  Top 0.152: U$1.8 31.37,9.12 30.94,8.69 | 30.94,8.69 30.18,7.92 28.14,7.92 TP17.TP | U$1.8 | 30.94,8.69 v30.63,8.99
  Bottom 0.152: Q2.1 24.71,26.34 26.49,24.56 Q1.1 26.54,23.11 26.54,22.89 30.63,18.8 v30.63,8.99
EPD_PANEL  (via drill 0.38)
  Top 0.152: U$1.4 31.8,11.12 26.52,16.41 TP13.TP 26.47,16.36 25.93,16.36 v25.65,16.08 | 23.39,16.08 23.39,15.8 23.14,15.54 Q5.1 | 23.39,16.08 23.39,22.78 22.84,23.34 Q7.1 | 23.39,16.08 v23.27,16.08
  Bottom 0.152: v23.27,16.08 v25.65,16.08
EPD_PWM  (via drill 0.38)
  Top 0.152: v22.96,26.59 22.96,25.32 25.93,22.35 25.93,20.52 v24,18.59 | v19.61,6.3 19.61,5.99 v21.11,4.5 | v32.64,3.1 32.64,2.85 32.84,2.64 | TP10.TP 32.84,2.64 | 32.84,2.64 34.04,3.83 34.04,4.37 U$1.19
  Bottom 0.152: v22.96,26.59 22.96,27.69 C14.1 | v24,18.59 24,17.68 18.29,11.96 18.29,6.6 18.64,6.25 19.56,6.25 v19.61,6.3 | v21.11,4.5 21.34,4.5 22.73,3.1 v32.64,3.1
EPD_RST  (via drill 0.38)
  Top 0.152: 28.3,10.87 29.03,10.13 32.31,10.13 U$1.6 | TP15.TP 28.3,10.87 | v20.02,28.3 20.02,27.84 24.59,23.27 v24.59,20.07 | 28.3,10.87 v28.52,11.1
  Bottom 0.152: v20.02,28.3 16.79,31.52 8.97,31.52 7.47,30.02 U$8.7 | v24.59,20.07 28.52,16.13 v28.52,11.1
GND  (via drill 0.38)
  Top 0.254: 29.64,6.27 29.64,5.13 C30.1 | 29.64,6.27 C28.2 29.74,7.29 30.4,7.29 v31.27,8.15 | U$1.16 32.31,5.11 31.47,5.11 31.32,4.95 29.95,4.95 C30.1 | 29.64,6.27 31.32,6.27 31.47,6.12 U$1.14 | 9.18,3.67 9.78,3.07 U$5.2 | 9.18,3.67 9.14,3.71 3.94,3.71 3.33,3.1 3.33,2.79 U$4.2 | 15.66,3.67 15.57,3.76 14.02,3.76 | 15.66,3.67 16.26,3.07 U$6.2 | 14.02,3.76 9.27,3.76 9.18,3.67 | 22.19,3.62 22.05,3.76 15.75,3.76 15.66,3.67 | 22.19,3.62 22.73,3.07 U$7.2 | C30.1 29.54,5.05 29.36,5.05 28.68,4.37 24.23,4.37 23.57,3.71 22.28,3.71 22.19,3.62 | 19.36,29.46 22.23,29.46 C20.1 | 19.36,29.46 C19.1 | v19.36,26.62 19.36,29.46 | 14.05,12.32 15.06,12.32 C21.2 | 14.05,12.32 11.66,14.71 10.79,14.71 10.06,15.44 C18.1 10.06,15.54 10.06,16.23 | 10.06,16.23 10.06,16.71 C17.1 10.06,16.82 10.06,17.88 C16.1 10.06,17.98 10.06,19.15 C15.1 10.06,19.25 10.79,19.99 11.76,19.99 15.11,23.34 15.32,23.34 Q7.2 15.04,23.44 15.04,26.52 | v9.17,17.02 9.96,16.23 10.06,16.23 | C3.1 2.13,32 v4.6,32 4.7,32.08 8.71,32.08 9.58,32.94 11.81,32.94 15.04,29.72 15.04,26.52 | v15.14,26.52 15.04,26.52 | 14.02,3.76 14.02,12.22 14.05,12.32 | 37.29,14.17 37.08,13.97 37.08,13.39 U$1.56 | 37.29,14.17 40.34,14.17 40.54,13.97 | 40.54,13.97 40.54,13.39 U$1.49 | 47.22,26.92 46,25.7 46,24.16 46.69,23.47 C2.2 46.74,21.79 47.68,20.85 R2.1 47.68,20.75 47.68,19.63 | 47.22,26.92 47.32,27.03 47.75,27.03 48.06,27.33 48.06,27.86 U$3.3 | 46.46,30.35 U$3.20 | 46.46,30.35 46.25,30.15 46.25,27.89 47.22,26.92 | v47.47,32.38 47.57,32.38 48.06,31.9 48.06,31.37 U$3.18 | v46.02,30.81 46.38,30.45 46.46,30.35 | 47.68,19.63 47.68,17.78 44.07,14.17 43.13,14.17 43.1,14.2 41.53,14.2 41.38,14.05 40.64,14.05 40.54,13.97
  Top 0.254: 50.23,32.55 49.58,31.9 49.58,31.37 U$3.15 | 50.23,32.55 51.54,33.86 R5.2 54.43,33.91 55.12,34.59 56.08,34.59 56.26,34.42 56.26,33.6 | U$3.9 51.64,27.86 56.26,32.49 56.26,33.6 | v47.45,35.08 47.7,35.08 50.23,32.55 | 56.26,33.6 v57.4,33.6 | U$1.39 41.33,8.13 41.96,8.13 42.47,8.64 43.76,8.64 C29.2 43.87,8.71 44.42,8.71 47.32,11.61 47.4,11.61 49.78,13.99 49.78,14.22 50.16,14.61 50.8,14.61 50.88,14.53 56.03,14.53 56.62,15.11 R18.2 C23.2 | 58.42,18.97 58.55,18.97 U$9.9 | 58.42,18.97 58.19,18.97 U$9.8 58.17,19.1 58.17,19.66 | U$9.P$18 57.78,21.95 57.78,22.96 U$9.6 | 58.17,19.66 58.17,19.96 57.99,20.14 U$9.13 | U$9.13 59.59,21.77 60.58,21.77 61.06,22.25 61.06,23.9 60.43,24.54 C25.2 59.51,24.64 v59.51,25.86 | 58.42,18.97 58.42,15.77 58.01,15.37 58.01,15.29 C23.2 | 58.17,19.66 55.6,19.66 C24.2 55.5,19.66 54.23,19.66 C22.2 54.13,19.63 47.68,19.63 | U$9.P$17 U$9.13 | U$9.13 58.45,20.47 58.75,20.17 U$9.P$16 58.9,20.17 U$9.P$15 | U$9.P$18 | U$9.P$18 U$9.13 | U$9.P$19 58.78,21.74 59.08,21.44 U$9.13 | U$9.P$20 U$9.13 | JP2.1 60.83,13.03 58.34,15.52 C23.2 | v37.08,14.4 37.21,14.28 37.29,14.17
  Bottom 0.254: Q1.2 26.49,21.89 24.71,23.67 24.71,25.04 Q2.2 24.59,25.04 21.01,25.04 19.53,26.52 19.36,26.52 | 19.36,26.52 16.38,26.52 D3.2 16.26,26.52 v15.14,26.52 | v19.36,26.62 19.36,26.52 | v9.17,17.02 U$8.33 | v4.6,32 5.84,32 U$8.3 | v47.47,32.38 47.14,32.38 46.97,32.56 46.41,32.56 46.02,32.18 v46.02,30.81 | C27.2 64.87,35.03 63.45,35.03 62.31,33.88 61.65,33.88 U$2.29 | U$2.29 62.36,33.78 62.76,33.38 62.76,28.45 62,27.69 61.65,27.69 U$2.28 61.52,27.61 60.07,27.61 59.59,27.13 59.59,25.93 v59.51,25.86 | 59.33,35.51 U$2.12 | 59.33,35.51 60.91,33.93 61.52,33.93 U$2.29 | v47.45,35.08 46.15,36.37 46.15,36.85 U$2.1 | v57.4,33.6 59.23,35.43 59.33,35.51 | C26.2 54.33,3.73 54.33,3.23 JP3.1 56.16,1.57 59.16,4.57 C1.2 60.55,4.62 61.06,4.12 61.67,4.12 JP1.GND 61.75,4.01 64.34,1.42 JP1.MT2 64.24,1.7 65.58,3.05 65.58,8.1 64.39,9.3 JP1.MT1 64.34,12.8 JP2.1 | v31.27,8.15 31.27,8.59 v37.08,14.4
LED_0  (via drill 0.38)
  Top 0.152: D5.C 5.84,5.03 v6.43,4.45 | v9.68,1.19 33.05,1.19 33.25,0.99 37.57,0.99 39.52,2.95 39.52,4.34 39.55,4.37 U$1.30
  Bottom 0.152: v9.68,1.19 v6.43,4.45
LED_1  (via drill 0.38)
  Top 0.152: D6.C 13.01,4.95 v13.36,5.31 | v40.13,2.72 40.13,4.32 40.08,4.37 U$1.31
  Bottom 0.152: v13.36,5.31 14.25,5.31 17.07,2.49 34.75,2.49 35.87,3.61 37.47,3.61 38.35,2.72 v40.13,2.72
LED_2  (via drill 0.38)
  Top 0.152: v18.9,6.86 17.2,5.16 D7.C | v27.91,15.88 27.91,19.63 30.48,22.2 33.07,22.2 v40.44,14.83 | v41.2,3.58 40.56,4.22 U$1.32
  Bottom 0.152: v27.91,15.88 v18.9,6.86 | v40.44,14.83 40.44,13.28 45.36,8.36 45.36,7.75 v41.2,3.58
LED_3  (via drill 0.38)
  Top 0.152: D8.C 24.49,4.88 25.09,5.49 v28.85,5.49 | v41.2,4.47 41.2,5 41.3,5.11 U$1.33
  Bottom 0.152: v28.85,5.49 30.3,5.49 31.32,4.47 v41.2,4.47
N$1
  Top 0.152: R5.1 55.45,33.86 52.96,31.37 U$3.12
N$2
  Bottom 0.152: D1.C 65.05,23.44 63.55,23.44 63.09,23.9 R4.2
N$3  (via drill 0.38)
  Top 0.152: v60.25,26.85 60.25,26.92 57.71,29.46 v56.08,29.46 | v52.91,32.21 50.95,32.21 50.57,31.83 U$3.13
  Bottom 0.152: D9.C 61.37,23.04 60.88,23.52 60.88,25.83 60.25,26.47 v60.25,26.85 | v56.08,29.46 55.65,29.46 v52.91,32.21
N$4
  Bottom 0.152: D2.C 63.6,20.6 R3.2
N$5  (via drill 0.38)
  Top 0.152: R2.2 49.48,20.85 50.37,21.74 | TP2.TP 50.37,21.74 | 50.37,21.74 R1.1 48.67,23.55 49.33,24.21 49.33,25.22 49.23,25.32 v49.23,25.86 | U$3.2 47.22,27.86 v46.91,28.17
  Bottom 0.152: v49.23,25.86 v46.91,28.17
N$6  (via drill 0.38)
  Top 0.152: v46.91,31.01 47.24,31.34 47.55,31.34 U$3.19 | v55.42,10.03 TP1.TP
  Bottom 0.152: v46.91,31.01 46.91,29.03 45.49,27.61 45.49,18.03 51.41,12.12 L1.1 51.66,12.06 52.53,12.06 54.56,10.03 v55.42,10.03
N$7
  Top 0.152: C30.2 29.84,3.63 32.31,3.63 33.05,4.37 U$1.17
N$8  (via drill 0.38)
  Top 0.152: v20.62,20.04 20.62,18.01 21.39,17.25 21.39,14.38 20.19,13.18 Q4.3
  Bottom 0.152: v20.62,20.04 20.62,22.28 R13.2
N$9
  Bottom 0.152: C14.2 15.44,27.69 14.53,26.77 14.53,26.26 15.21,25.58 D3.3
N$10  (via drill 0.38)
  Top 0.152: v62.46,25.73 62.46,29.41 56.19,35.69 47.19,35.69 46.84,35.33 46.84,34.57 47.14,34.27 47.14,32.92 46.69,32.46 v46.69,31.9 | v49.99,26.82 49.99,27.79 U$3.7
  Bottom 0.152: R4.1 63.09,22.78 62.41,23.47 62.41,25.68 v62.46,25.73 | v46.69,31.9 46.89,31.9 47.7,31.09 47.7,28.83 49.71,26.82 v49.99,26.82
N$11  (via drill 0.38)
  Top 0.152: v64.72,18.19 64.72,22.61 60.86,26.47 60.86,27.1 57.89,30.07 54.43,30.07 51.49,27.13 50.85,27.13 50.57,27.41 U$3.8
  Bottom 0.152: v64.72,18.19 64.24,18.67 R3.1
N$12  (via drill 0.38)
  Top 0.152: v46.28,26.92 45.41,27.79 45.41,31.62 46.53,32.74 R6.1 | v47.6,26.36 48.56,27.33 U$3.4
  Bottom 0.152: v46.28,26.92 47.04,26.92 v47.6,26.36
N$13  (via drill 0.38)
  Top 0.152: v2.82,3.96 2.82,3.66 2.16,3 U$4.1 2.21,2.74 2.21,2.54 2.82,1.93 3.81,1.93 4.45,2.56 4.45,2.79 U$4.1'
  Bottom 0.152: v2.82,3.96 2.82,5.08 R7.2
N$14  (via drill 0.38)
  Top 0.152: v11.86,3.1 11.25,3.1 U$5.1' 10.9,2.74 10.9,2.54 10.29,1.93 9.3,1.93 8.64,2.59 U$5.1
  Bottom 0.152: v11.86,3.1 10.39,4.57 R8.2
N$15  (via drill 0.38)
  Top 0.152: v18.34,3.1 17.73,3.1 17.42,2.79 U$6.1' 17.37,2.74 17.37,2.54 16.76,1.93 15.77,1.93 15.11,2.59 U$6.1
  Bottom 0.152: v18.34,3.1 16.99,4.45 16.99,5 R9.2
N$16  (via drill 0.38)
  Top 0.152: v24.77,3.71 24.77,3.66 U$7.1' 23.85,2.74 23.85,2.54 23.24,1.93 22.25,1.93 21.59,2.59 U$7.1
  Bottom 0.152: R10.2 23.7,4.78 v24.77,3.71
N$26  (via drill 0.38)
  Top 0.152: v4.01,27.61 C4.2
  Bottom 0.152: v4.01,27.61 4.24,27.61 5.13,28.5 5.84,28.5 U$8.10
N$27  (via drill 0.38)
  Top 0.152: v3.99,26.72 3.58,26.31 2.59,26.31 C4.1
  Bottom 0.152: v3.99,26.72 4.9,27.64 4.9,27.76 5.16,28.02 U$8.11
N$28  (via drill 0.38)
  Top 0.152: v9.04,30.3 9.04,30.5 10.03,31.5 C5.2
  Bottom 0.152: U$8.12 5.84,27.51 6.55,27.51 6.58,27.53 6.76,27.53 8.05,28.83 8.05,29.74 8.61,30.3 v9.04,30.3
N$29  (via drill 0.38)
  Top 0.152: v12.5,30.61 11.58,31.52 11.38,31.52 11.35,31.55 11.35,32.21 C5.1
  Bottom 0.152: U$8.13 6.55,27.03 6.58,27.05 6.78,27.05 6.83,27.1 6.83,27.18 8.28,28.63 9.91,28.63 11.89,30.61 v12.5,30.61 12.57,30.61
N$30  (via drill 0.38)
  Top 0.152: v11.33,30.91 11.33,29.92 C6.2 | v7.09,29.21 7.09,28.96 v3.96,25.83
  Bottom 0.152: v11.33,30.91 8.79,30.91 v7.09,29.21 | v3.96,25.83 4.47,25.83 5.16,26.52 U$8.14
N$31  (via drill 0.38)
  Top 0.152: v8.53,28.02 8.53,28.5 9.42,29.39 10.03,29.39 C6.1
  Bottom 0.152: U$8.15 6.55,26.01 6.58,26.04 6.78,26.04 6.83,26.09 6.83,26.67 7.14,26.98 7.14,27.05 8.15,28.07 8.53,28.07 v8.53,28.02
N$32  (via drill 0.38)
  Top 0.152: v12.22,28.65 11.38,28.65 11.35,28.68 11.33,28.65 C7.2
  Bottom 0.152: U$8.16 6.55,25.53 6.58,25.55 6.78,25.55 6.83,25.6 6.83,25.65 7.14,25.96 7.14,26.54 7.44,26.85 7.44,26.92 7.92,27.41 8.79,27.41 9.7,28.32 10.03,28.32 10.36,28.65 v12.22,28.65
N$33  (via drill 0.38)
  Top 0.152: v8.18,26.8 9.4,28.02 9.4,28.09 9.42,28.12 10.03,28.12 C7.1
  Bottom 0.152: U$8.17 6.55,25.02 6.58,25.04 6.78,25.04 6.83,25.09 6.83,25.17 7.14,25.48 7.14,25.53 7.44,25.83 7.44,26.42 7.57,26.54 7.92,26.54 v8.18,26.8
N$34  (via drill 0.38)
  Top 0.152: v12.22,27.23 11.35,27.23 11.35,27.38 C8.2
  Bottom 0.152: U$8.18 6.55,24.51 6.58,24.54 6.78,24.54 6.83,24.59 6.83,24.66 7.14,24.97 7.14,25.04 7.44,25.35 7.44,25.4 7.67,25.63 7.87,25.63 9.47,27.23 v12.22,27.23
N$35  (via drill 0.38)
  Top 0.152: v8.61,25.5 8.61,26.04 9.42,26.85 10.03,26.85 C8.1
  Bottom 0.152: v8.61,25.5 8.18,25.5 7.82,25.15 7.67,25.15 7.44,24.92 7.44,24.84 7.14,24.54 7.14,24.46 6.83,24.16 6.83,24.11 6.78,24.05 6.58,24.05 6.55,24.03 U$8.19
N$36  (via drill 0.38)
  Top 0.152: v8.2,24.64 8.61,24.64 9.4,25.43 9.4,25.55 9.42,25.58 10.03,25.58 C9.1
  Bottom 0.152: U$8.20 6.55,23.52 6.58,23.55 6.78,23.55 6.83,23.6 6.83,23.67 7.14,23.98 7.14,24.03 7.44,24.33 7.44,24.41 7.85,24.82 8.03,24.82 v8.2,24.64 | U$8.20
N$37  (via drill 0.38)
  Top 0.152: v12.22,26.11 11.38,26.11 11.35,26.14 11.33,26.11 C9.2
  Bottom 0.152: U$8.21 6.55,23.01 6.58,23.04 7.47,23.04 10.54,26.11 v12.22,26.11
N$38  (via drill 0.38)
  Top 0.152: v13.11,23.09 11.35,24.84 C10.1 | v3.33,19.07 v7.47,19.07
  Bottom 0.152: v13.11,23.09 13.11,21.64 10.54,19.07 v7.47,19.07 | v3.33,19.07 3.33,20.7 5.13,22.5 5.84,22.5 U$8.22
N$39  (via drill 0.38)
  Top 0.152: v8.87,23.57 8.87,23.75 9.42,24.31 10.03,24.31 C10.2
  Bottom 0.152: U$8.23 6.55,22.02 6.58,22.05 6.91,22.05 8.43,23.57 v8.87,23.57
N$40  (via drill 0.38)
  Top 0.152: v7.59,21.54 8.51,21.54 9.4,22.43 9.4,23.01 9.42,23.04 10.03,23.04 C11.1
  Bottom 0.152: U$8.24 6.55,21.51 6.58,21.54 6.78,21.54 6.86,21.61 7.52,21.61 v7.59,21.54
N$41  (via drill 0.38)
  Top 0.152: v3.99,19.68 4.29,19.38 6.91,19.38 7.85,20.32 8.59,20.32 8.94,20.68 8.94,21.11 9.4,21.57 10.67,21.57 10.69,21.59 10.69,23.01 10.72,23.04 11.35,23.04 11.35,23.57 C11.2
  Bottom 0.152: U$8.25 5.13,21.03 5.08,21.08 4.14,21.08 3.63,20.57 3.63,20.04 v3.99,19.68
N$42  (via drill 0.38)
  Top 0.152: v8.33,20.93 9.63,22.23 10.03,22.23 C12.1
  Bottom 0.152: U$8.26 6.55,20.52 6.58,20.55 7.47,20.55 7.87,20.95 8.31,20.95 v8.33,20.93
N$43  (via drill 0.38)
  Top 0.152: C12.2 11.73,22.3 v12.22,22.78 | v8.26,22.15 6.4,22.15 v4.6,20.34
  Bottom 0.152: v12.22,22.78 8.89,22.78 v8.26,22.15 | v4.6,20.34 4.83,20.34 5.13,20.04 5.84,20.04 U$8.27
N$44  (via drill 0.38)
  Top 0.152: v12.14,21.54 11.4,21.54 11.35,21.49 11.35,20.78 C13.1
  Bottom 0.152: U$8.28 5.84,19.53 6.55,19.53 6.58,19.56 6.78,19.56 6.91,19.68 7.72,19.68 8.03,19.38 10.41,19.38 11.35,20.32 11.35,20.78 12.12,21.54 v12.14,21.54
N$45  (via drill 0.38)
  Top 0.152: v4.24,18.47 4.55,18.77 6.91,18.77 7.21,18.47 7.9,18.47 9.47,20.04 10.01,20.04 10.03,20.07 C13.2
  Bottom 0.152: U$8.29 5.13,19.02 5.11,19 4.9,19 4.37,18.47 v4.24,18.47 4.01,18.47
N$46  (via drill 0.38)
  Top 0.152: v3.48,30.68 C3.2
  Bottom 0.152: v3.48,30.68 5.13,29.03 5.84,29.03 U$8.9
N$47  (via drill 0.38)
  Top 0.152: v23.16,31.5 R15.1 | v28.27,28.78 28.27,27.99 28.7,27.56 U$10.3
  Bottom 0.152: v23.16,31.5 25.55,31.5 v28.27,28.78
N$48
  Top 0.152: D5.A 2.59,6.07 2.26,6.4 2.26,7.47 2.41,7.62 3.45,7.62 4.14,6.93 R23.1
N$49
  Bottom 0.152: 21.97,19.3 22.53,19.86 R12.1 | 21.97,19.3 21.84,19.18 20.78,19.18 Q3.1 | R13.1 21.92,19.36 21.97,19.3
N$50
  Top 0.152: R17.1 21.51,34.09 22.78,34.09 24.16,32.72 C20.2 24.18,32.64 24.18,32.51 27.66,29.03 27.66,25.35 U$10.1 27.74,25.32 27.74,21.46 24.08,17.8 Q5.3
N$51
  Top 0.152: D6.A 9.14,4.95 9.14,5.59 10.41,6.86 R24.1
N$52  (via drill 0.38)
  Top 0.152: v16.97,22.48 16.94,22.48 15.98,21.51 Q7.3 | v17.6,24.61 17.6,30.53 18.14,31.06 18.14,32.03 18.9,32.79 R17.2
  Bottom 0.152: v16.97,22.48 16.97,23.67 17.6,24.31 v17.6,24.61
N$54  (via drill 0.38)
  Top 0.152: v57.76,16.05 57.76,18.95 U$9.7 | v58.93,13.99 58.04,13.99 57.94,13.89 C23.1 57.89,13.89 56.72,13.89 R18.1
  Bottom 0.152: v57.76,16.05 57.76,15.16 v58.93,13.99
N$55
  Top 0.152: D7.A 15.7,5.16 15.7,5.26 17.17,6.73 R25.1
N$56
  Top 0.152: D8.A 22.05,4.88 22.05,5.38 23.52,6.86 R26.1
PM_BIN  (via drill 0.38)
  Top 0.152: U$1.37 41.33,7.14 46.46,7.14 50.95,11.63 TP6.TP 50.95,13.95 | U$9.1 59.97,22.96 v60.4,22.53 | 50.95,13.95 51.38,13.95 51.44,13.89 R21.2 | 50.95,13.95 v50.44,13.95
  Bottom 0.152: v60.4,22.53 60.4,21.74 59.44,20.78 57.28,20.78 v50.44,13.95
PM_GPOUT  (via drill 0.38)
  Top 0.152: v60.2,15.57 60.2,18.29 59.79,18.69 59.79,18.95 U$9.12 | v54.89,10.77 53.9,10.77 TP3.TP | R22.2 52.86,11.89 TP3.TP | TP3.TP 47.62,6.63 41.33,6.63 U$1.36
  Bottom 0.152: v60.2,15.57 59.54,14.91 59.54,13.74 58.09,12.29 56.41,12.29 v54.89,10.77
PM_SCL  (via drill 0.38)
  Top 0.152: v59.59,18.03 59.38,18.24 59.38,18.95 U$9.11 | TP4.TP v55.22,12.65 54.13,13.74 R19.2 | v56.69,12.9 57.66,11.94 57.66,9.68 57.15,9.17 51.51,9.17 48.46,6.12 41.33,6.12 U$1.35
  Bottom 0.152: v59.59,18.03 58.88,18.03 55.22,14.38 v55.22,12.65 55.27,12.9 v56.69,12.9
PM_SDA  (via drill 0.38)
  Top 0.152: v60.15,14.66 58.98,15.82 58.98,18.95 U$9.10 | v57.05,11.68 55.91,11.68 TP5.TP 55.85,11.73 55.85,12.98 55.45,13.39 R20.2 | v54.81,8.56 51.33,8.56 48.41,5.64 41.33,5.64 U$1.34
  Bottom 0.152: v60.15,14.66 60.15,13.92 57.91,11.68 v57.05,11.68 57,11.63 57,10.74 v54.81,8.56
SENSOR_DATA  (via drill 0.38)
  Top 0.152: U$1.2 U$1.1 32.26,12.68 32.26,15.62 | 32.26,15.62 32.26,19.94 TP11.TP | v49.33,5.69 JP3.2 | v32.31,15.62 32.26,15.62
  Bottom 0.152: v49.33,5.69 49.12,5.69 43.59,11.23 43.26,11.23 41.05,13.44 41.05,15.09 40.51,15.62 v32.31,15.62
SPI_CLK  (via drill 0.38)
  Top 0.152: v43.54,11.84 43.38,11.84 42.19,10.64 41.33,10.64 U$1.44 | v43.54,15.14 32.54,26.14 TP22.TP 28.42,34.7 20.37,34.7 18.21,32.54 v17.78,32.54
  Bottom 0.152: v43.54,15.14 v43.54,11.84 | v17.78,32.54 9.55,32.54 8.53,31.52 U$8.4
SPI_MISO  (via drill 0.38)
  Top 0.152: v44.42,12.72 44.42,11.86 43.79,11.23 43.2,11.23 42.11,10.13 41.33,10.13 U$1.43 | v44.42,15.47 44.42,15.16 43.79,14.53 43.28,14.53 28.88,28.93 28.88,30.38 TP24.TP v25.2,34.06
  Bottom 0.152: v44.42,15.47 v44.42,12.72 | v25.2,34.06 4.83,34.06 3.68,32.92 3.68,31.62 4.78,30.53 U$8.6
SPI_MOSI  (via drill 0.38)
  Top 0.152: v45.03,12.04 43.92,10.92 43.33,10.92 42.04,9.63 41.33,9.63 U$1.42 | v43.87,16.89 42.65,16.89 v37.47,22.07 | TP23.TP v30.53,28.14
  Bottom 0.152: v45.03,12.04 45.03,15.72 v43.87,16.89 | v37.47,22.07 36.6,22.07 v30.53,28.14 30.48,28.19 30.2,28.19 24.64,33.76 4.95,33.76 3.99,32.79 3.99,31.75 4.7,31.04 5.84,31.04 U$8.5
SPYBY_RST  (via drill 0.38)
  Top 0.152: 33.07,19 33.07,20.04 TP18.TP | 33.07,19 33.07,13.39 U$1.64 | v56.01,18.64 52.09,18.64 50.32,16.87 v48.56,16.87 | v47.02,18.06 46.05,18.06 45.49,17.5 42.9,17.5 v41.4,19 | v33.12,19 33.07,19
  Bottom 0.152: JP1.D+ 59.87,5.41 59.79,5.33 58.73,5.33 58.57,5.49 58.57,11.91 60.81,14.15 60.81,17.68 59.84,18.64 v56.01,18.64 | v48.56,16.87 48.21,16.87 v47.02,18.06 | v33.12,19 v41.4,19
SPYBY_TEST  (via drill 0.38)
  Top 0.152: 35.56,15.01 35.56,16.46 TP19.TP | 35.56,15.01 35.56,13.39 U$1.59 | v62.92,5.46 61.39,5.46 60.71,4.78 v51.33,4.78 | v46.2,7.75 45.11,7.75 v44.76,8.1 | 35.56,15.01 v37.85,15.01
  Bottom 0.152: v62.92,5.46 62.33,6.04 61.7,6.04 JP1.D- | v51.33,4.78 49.17,4.78 v46.2,7.75 | v37.85,15.01 v44.76,8.1
UART_RX  (via drill 0.38)
  Top 0.152: v49.38,18.97 42.04,11.63 41.33,11.63 U$1.46 | v50.52,20.8 51.16,21.44 51.31,21.44 51.77,21.89 51.77,26.42 53.87,28.52 v54.2,28.52 TP8.TP
  Bottom 0.152: v49.38,18.97 49.38,19.66 v50.52,20.8 | v54.2,28.52 54.46,28.52 58.12,24.87 58.12,24.49 U$2.14
UART_TX  (via drill 0.38)
  Top 0.152: v49.45,18.09 48.92,18.09 41.96,11.12 41.33,11.12 U$1.45 | v52.07,20.7 52.07,26.29 53.44,27.66 56.36,27.66 57.07,28.37 TP9.TP 58.32,27.61 v58.32,26.19
  Bottom 0.152: v52.07,20.7 v49.45,18.09 | v58.32,26.19 59.31,25.2 59.31,24.49 U$2.13
VCC  (via drill 0.38)
  Top 0.254: R23.2 2.95,6.93 3.68,6.2 8.46,6.2 9.12,6.86 R24.2 9.25,6.91 v10.19,7.85 | v14.76,7.85 15.8,6.81 R25.2 15.98,6.73 16.76,7.52 21.57,7.52 22.23,6.86 R26.2 22.35,6.91 24.23,8.79 25.73,8.79 26.8,9.86 26.8,9.96 | v31.04,5.61 U$1.15 | v31.27,7.14 31.73,7.59 32.31,7.59 U$1.11 | 28.74,8.62 27.41,9.96 26.8,9.96 | 28.74,8.62 28.83,8.53 29.64,8.53 C28.1 | 26.8,9.96 26.49,9.96 25.04,11.4 25.04,12.72 Q5.2 24.99,12.85 24.99,17.22 29.64,21.87 29.64,25.32 U$10.2 | v28.65,8.53 28.74,8.62 | v63.32,33.76 59.87,33.76 v58.14,35.48 | 42.56,9.31 41.88,8.64 41.33,8.64 U$1.40 | 42.56,9.31 43.18,9.93 43.76,9.93 C29.1 43.87,10.01 44.68,10.01 47.03,12.36 | 47.9,24.66 48.54,24.66 48.64,24.77 R1.2 | 47.9,24.66 46.74,24.66 C2.1 | R20.1 54.23,15.19 R19.1 52.96,15.19 R22.1 R21.1 51.33,15.27 v50.65,15.95 50.55,15.88 47.03,12.36 | 47.9,24.66 v47.9,21.84 48.01,21.77 48.34,21.44 48.34,20.3 48.59,20.04 52.35,20.04 52.73,20.42 52.73,26.44 53.47,27.18 v56.74,27.18 | v47.12,12.27 47.03,12.36 | v42.57,9.3 42.56,9.31
  Bottom 0.254: v14.76,7.85 v10.19,7.85 | v31.04,5.61 31.04,6.91 v31.27,7.14 | v28.65,8.53 30.2,6.99 30.94,6.99 v31.27,7.14 | JP3.3 53.01,3.28 C26.1 52.93,3.83 52.93,7.39 L1.2 51.51,8.79 50.6,8.79 v47.12,12.27 | v63.32,33.76 64.87,33.76 C27.1 | U$2.11 v58.14,35.48 58.04,35.41 56.44,35.41 55.83,34.8 55.83,30.66 56.74,29.74 v56.74,27.18 | v47.9,21.84 47.9,18.69 v50.65,15.95 | v42.57,9.3 40.44,7.16 31.39,7.16 v31.27,7.14
VCC_R  (via drill 0.38)
  Top 0.152: U$9.5 58.17,24.28 57.91,24.54 C25.1 58.12,24.11 v57.1,23.09 57.05,23.04 57.05,21.36 56.03,20.34 53.7,20.34 53.54,20.5 53.54,21.41 TP7.TP | v60.27,23.75 59.82,23.75 59.38,23.32 59.38,22.96 U$9.2
  Bottom 0.152: v60.27,23.75 60.2,23.75 59.54,23.09 v57.1,23.09
VCC_T  (via drill 0.38)
  Top 0.152: TP30.TP 19.76,13.13 19.25,12.62 Q4.2 19.18,12.57 v16.76,12.57 | R15.2 16.99,31.06 16.99,29.46 C19.2 16.94,29.62 v16.1,28.78
  Bottom 0.152: v16.1,28.78 14.22,26.9 14.22,22.33 9.96,18.06 5.89,18.06 U$8.31 U$8.32 5.79,17.48 5.11,17.48 3.99,16.36 3.99,13.31 5.31,11.99 14.02,11.99 14.61,12.57 v16.76,12.57
VCOM  (via drill 0.38)
  Top 0.152: 15.06,14.22 15.06,16.89 15.27,17.09 R11.2 15.32,17.14 15.93,17.75 v15.93,17.98 | 15.06,14.22 C21.1 | 15.06,14.22 v13.59,14.22
  Bottom 0.152: U$8.39 U$8.40 5.89,13.49 7.7,13.49 8.28,12.9 12.27,12.9 v13.59,14.22 | v15.93,17.98 16.56,18.62 16.56,18.97 R14.2
VCOM_DRIVER  (via drill 0.38)
  Top 0.152: v16.59,14.12 R11.1
  Bottom 0.152: v16.59,14.12 16.59,13.61 17.37,12.83 17.37,12.32 16.74,11.68 5.18,11.68 3.68,13.18 3.68,17.04 5.16,18.52 U$8.30
VDH  (via drill 0.38)
  Top 0.152: v8.53,13.51 TP28.TP | v22.78,22.53 18.03,22.53 12.22,16.71 | C17.2 12.22,16.71 | v12.22,16.66 12.22,16.71
  Bottom 0.152: U$8.36 6.53,15.52 v8.53,13.51 8.59,13.56 9.12,13.56 v12.22,16.66 | v22.78,22.53 Q1.3
VDL  (via drill 0.38)
  Top 0.152: v4.6,15.44 TP29.TP | C18.2 11.51,15.44 13.95,13.01 16.33,13.01 v20.32,16.99
  Bottom 0.152: v4.6,15.44 4.72,15.44 5.13,15.04 | 5.13,15.04 5.84,15.04 U$8.37 | 21.16,17.88 21.84,17.88 22.53,18.57 R12.2 | 21.16,17.88 20.78,17.88 Q3.2 | 21.16,17.88 21.16,17.83 v20.32,16.99 20.27,16.94 18.54,16.94 13.89,12.29 5.44,12.29 4.6,13.13 4.6,14.5 5.13,15.04
VGH  (via drill 0.38)
  Top 0.152: TP26.TP 10.79,12.65 v7.09,16.36 | v21.29,25.7 19.56,25.7 17.8,23.95 16.18,23.95 15.93,23.7 15.93,22.91 12.27,19.25 | C15.2 12.27,19.25 | v12.22,19.2 12.27,19.25
  Bottom 0.152: U$8.34 6.55,16.51 6.71,16.36 v7.09,16.36 7.14,16.41 9.42,16.41 v12.22,19.2 | v21.29,25.7 Q2.3
VGL  (via drill 0.38)
  Top 0.152: v12.22,17.98 C16.2 | TP27.TP 10.92,13.44 v9.17,15.19
  Bottom 0.152: 9.2,15.75 11.43,17.98 v12.22,17.98 16.36,22.12 16.36,24.61 D3.1 | 9.2,15.75 6.81,15.75 6.55,16 5.84,16 U$8.35 | v9.17,15.19 9.17,15.7 9.2,15.75
VUSB  (via drill 0.38)
  Top 0.152: v51.16,26.16 49.78,26.16 49.38,26.57 49.38,27.08 49.55,27.25 49.55,27.86 U$3.6 | v53.39,22.53 v53.39,26.16
  Bottom 0.152: C1.1 59.26,5.94 60.35,5.94 61.11,6.71 61.67,6.71 JP1.VBUS 61.7,6.78 61.7,19.99 | 61.85,19.99 61.7,19.99 | 61.7,19.99 D9.A 61.34,20.07 60.88,20.52 60.88,21.74 61.01,21.87 61.01,22.78 60.66,23.14 60.15,23.14 59.49,22.48 56.84,22.48 56.79,22.53 v53.39,22.53 | 61.85,19.99 62.56,19.28 64.95,19.28 65.1,19.13 D2.A | 61.85,19.99 63.78,21.92 D1.A | v53.39,26.16 v51.16,26.16